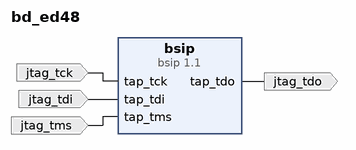
[diagram p0: block diagram of the top level]
# Vivado block design bd_ed48, xcku040-ffva1156-2-e, Vivado 2022.2
create_bd_design bd_ed48

create_bd_port -dir I jtag_tdi
create_bd_port -dir O jtag_tdo
create_bd_port -dir I jtag_tms
create_bd_port -dir I jtag_tck

create_bd_cell -type ip -vlnv xilinx.com:ip:bsip:1.1 bsip
set_property -dict [list \
  CONFIG.C_CHIP_ID 0 \
  CONFIG.C_DEVICE_FAMILY 0 \
  CONFIG.C_EN_MUX 0 \
  CONFIG.C_EN_MUX_EXT_BS 0 \
  CONFIG.C_IR_ID_INSTR 0 \
  CONFIG.C_IR_USER1_INSTR 0 \
  CONFIG.C_IR_WIDTH 0 \
  CONFIG.C_USER_SCAN_CHAIN 1 \
  CONFIG.C_USE_SOFTBSCAN 1 \
] [get_bd_cells bsip]

# ---- connections ----

connect_bd_net [get_bd_pins bsip/tap_tdo] [get_bd_ports jtag_tdo]
connect_bd_net [get_bd_ports jtag_tck] [get_bd_pins bsip/tap_tck]
connect_bd_net [get_bd_ports jtag_tdi] [get_bd_pins bsip/tap_tdi]
connect_bd_net [get_bd_ports jtag_tms] [get_bd_pins bsip/tap_tms]

validate_bd_design
save_bd_design
